# EAGLE design LIC_rack_BM4-01 (EAGLE 7.2.0)
AUTHOR: M. Petrilak; VERSION: 01

## Sheet 1 of 2
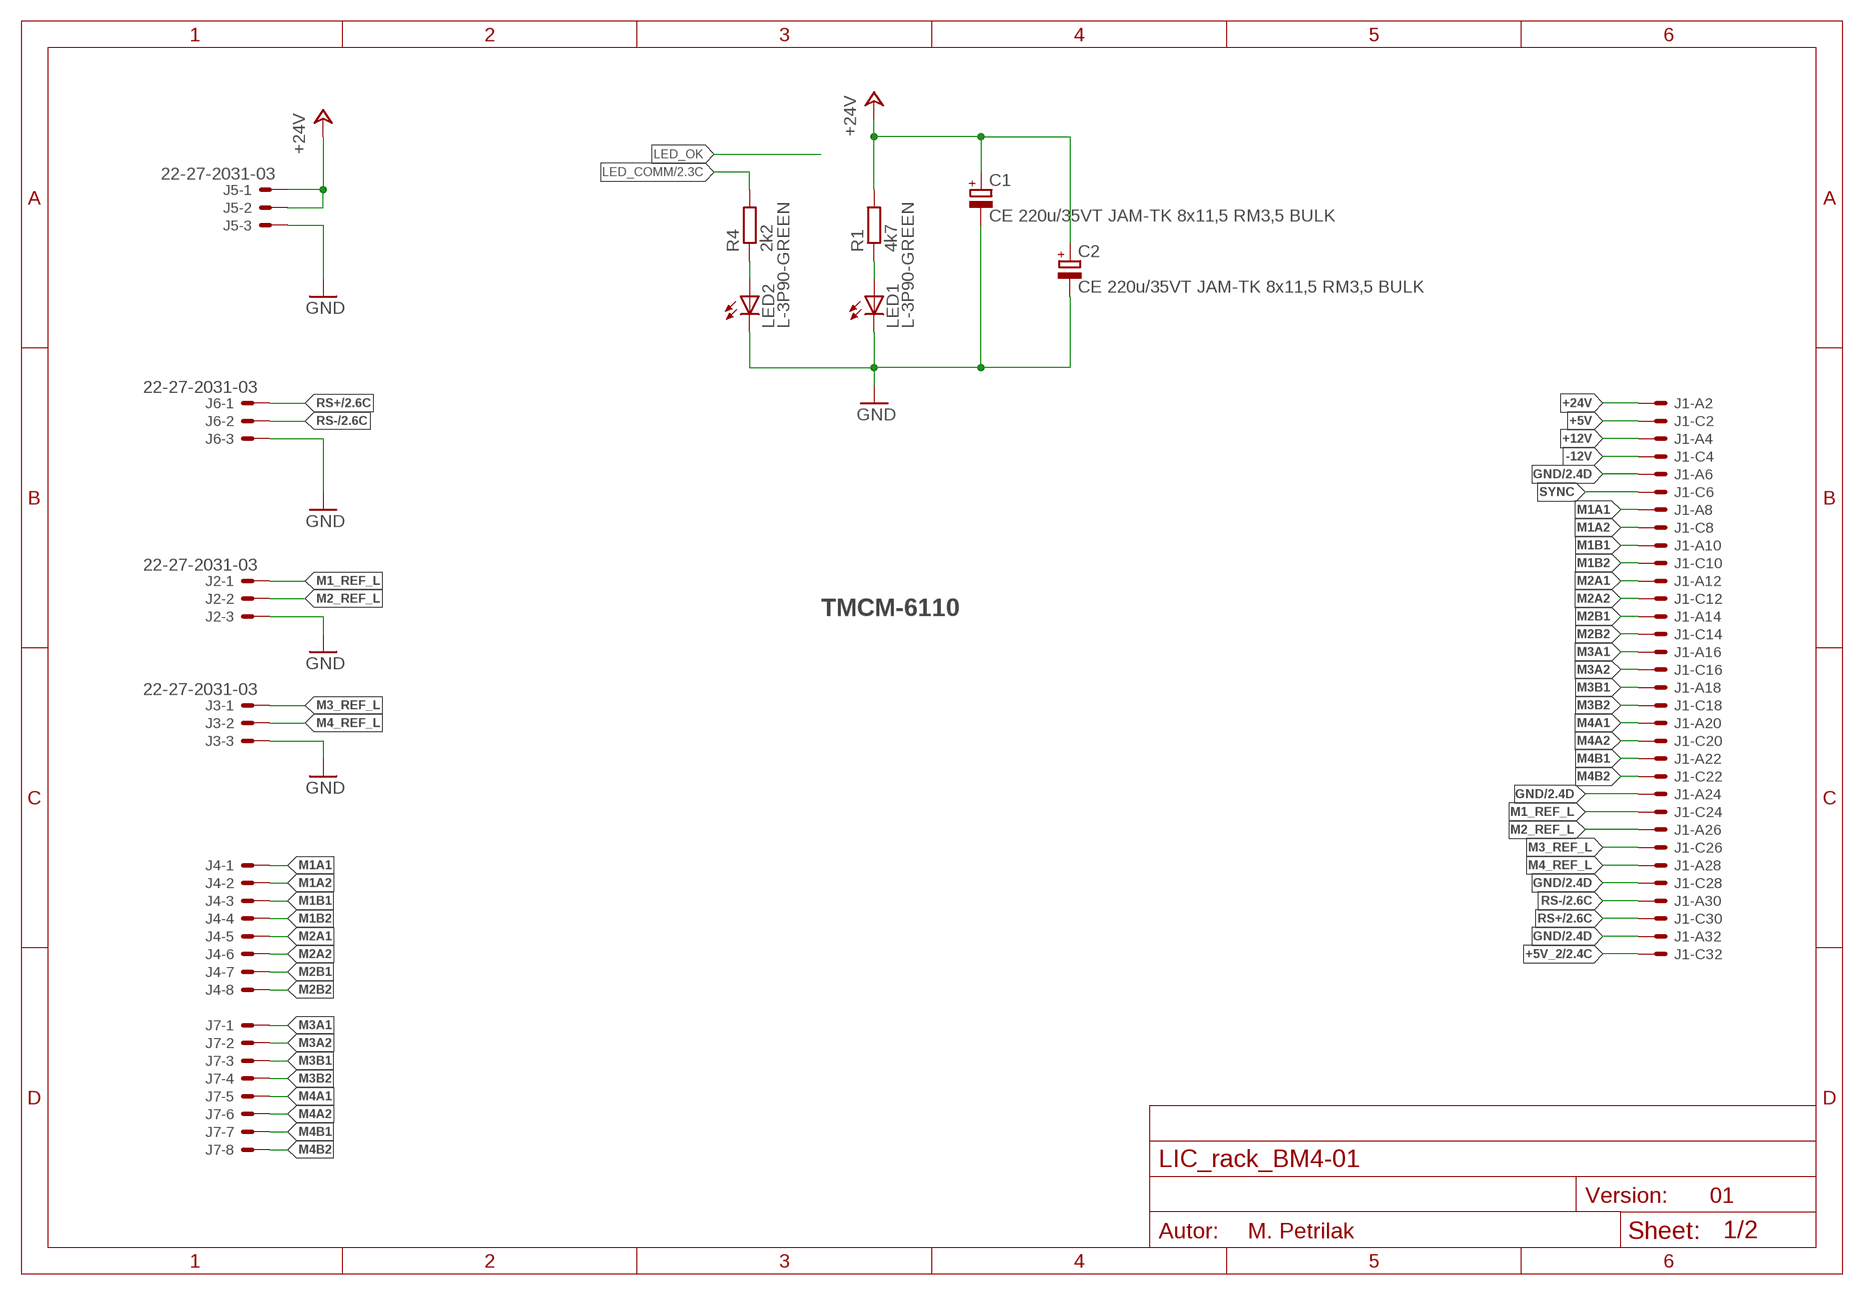
[diagram p0: schematic, sheet 1]

### Parts
C1  CE 220u/35VT JAM-TK 8x11,5 RM3,5 BULK  CPOL-EUE3.5-8L  [E3,5-8L]
C2  CE 220u/35VT JAM-TK 8x11,5 RM3,5 BULK  CPOL-EUE3.5-8L  [E3,5-8L]
J1  VG32SP  [VG32P]
J2  22-27-2031-03  [6410-03]
J3  22-27-2031-03  [6410-03]
J4  22-27-2081-08  [6410-08]
J5  22-27-2031-03  [6410-03]
J6  22-27-2031-03  [6410-03]
J7  22-27-2081-08  [6410-08]
LED1  L-3P90-GREEN  [L-3P90]
LED2  L-3P90-GREEN  [L-3P90]
R1  4k7  R-EU_R1206  [R1206]
R4  2k2  R-EU_R1206  [R1206]

### Nets
+5V: J1.C2
+5V_2: J1.C32 ; also sheet 2
+12V: J1.A4
+24V: C1.+ C2.+ J1.A2 J5.1 J5.2 R1.2
-12V: J1.C4
GND: C1.- C2.- J1.A6 J1.A24 J1.A32 J1.C28 J2.3 J3.3 J5.3 J6.3 LED1.K(C) LED2.K(C) ; also sheet 2
LED_COMM: R4.2 ; also sheet 2
M1_REF_L: J1.C24 J2.1
M1A1: J1.A8 J4.1
M1A2: J1.C8 J4.2
M1B1: J1.A10 J4.3
M1B2: J1.C10 J4.4
M2_REF_L: J1.A26 J2.2
M2A1: J1.A12 J4.5
M2A2: J1.C12 J4.6
M2B1: J1.A14 J4.7
M2B2: J1.C14 J4.8
M3_REF_L: J1.C26 J3.1
M3A1: J1.A16 J7.1
M3A2: J1.C16 J7.2
M3B1: J1.A18 J7.3
M3B2: J1.C18 J7.4
M4_REF_L: J1.A28 J3.2
M4A1: J1.A20 J7.5
M4A2: J1.C20 J7.6
M4B1: J1.A22 J7.7
M4B2: J1.C22 J7.8
N$3: LED1.A R1.1
N$6: LED2.A R4.1
RS+: J1.C30 J6.1 ; also sheet 2
RS-: J1.A30 J6.2 ; also sheet 2
SYNC: J1.C6

### Notes on the sheet
- TMCM-6110

## Sheet 2 of 2
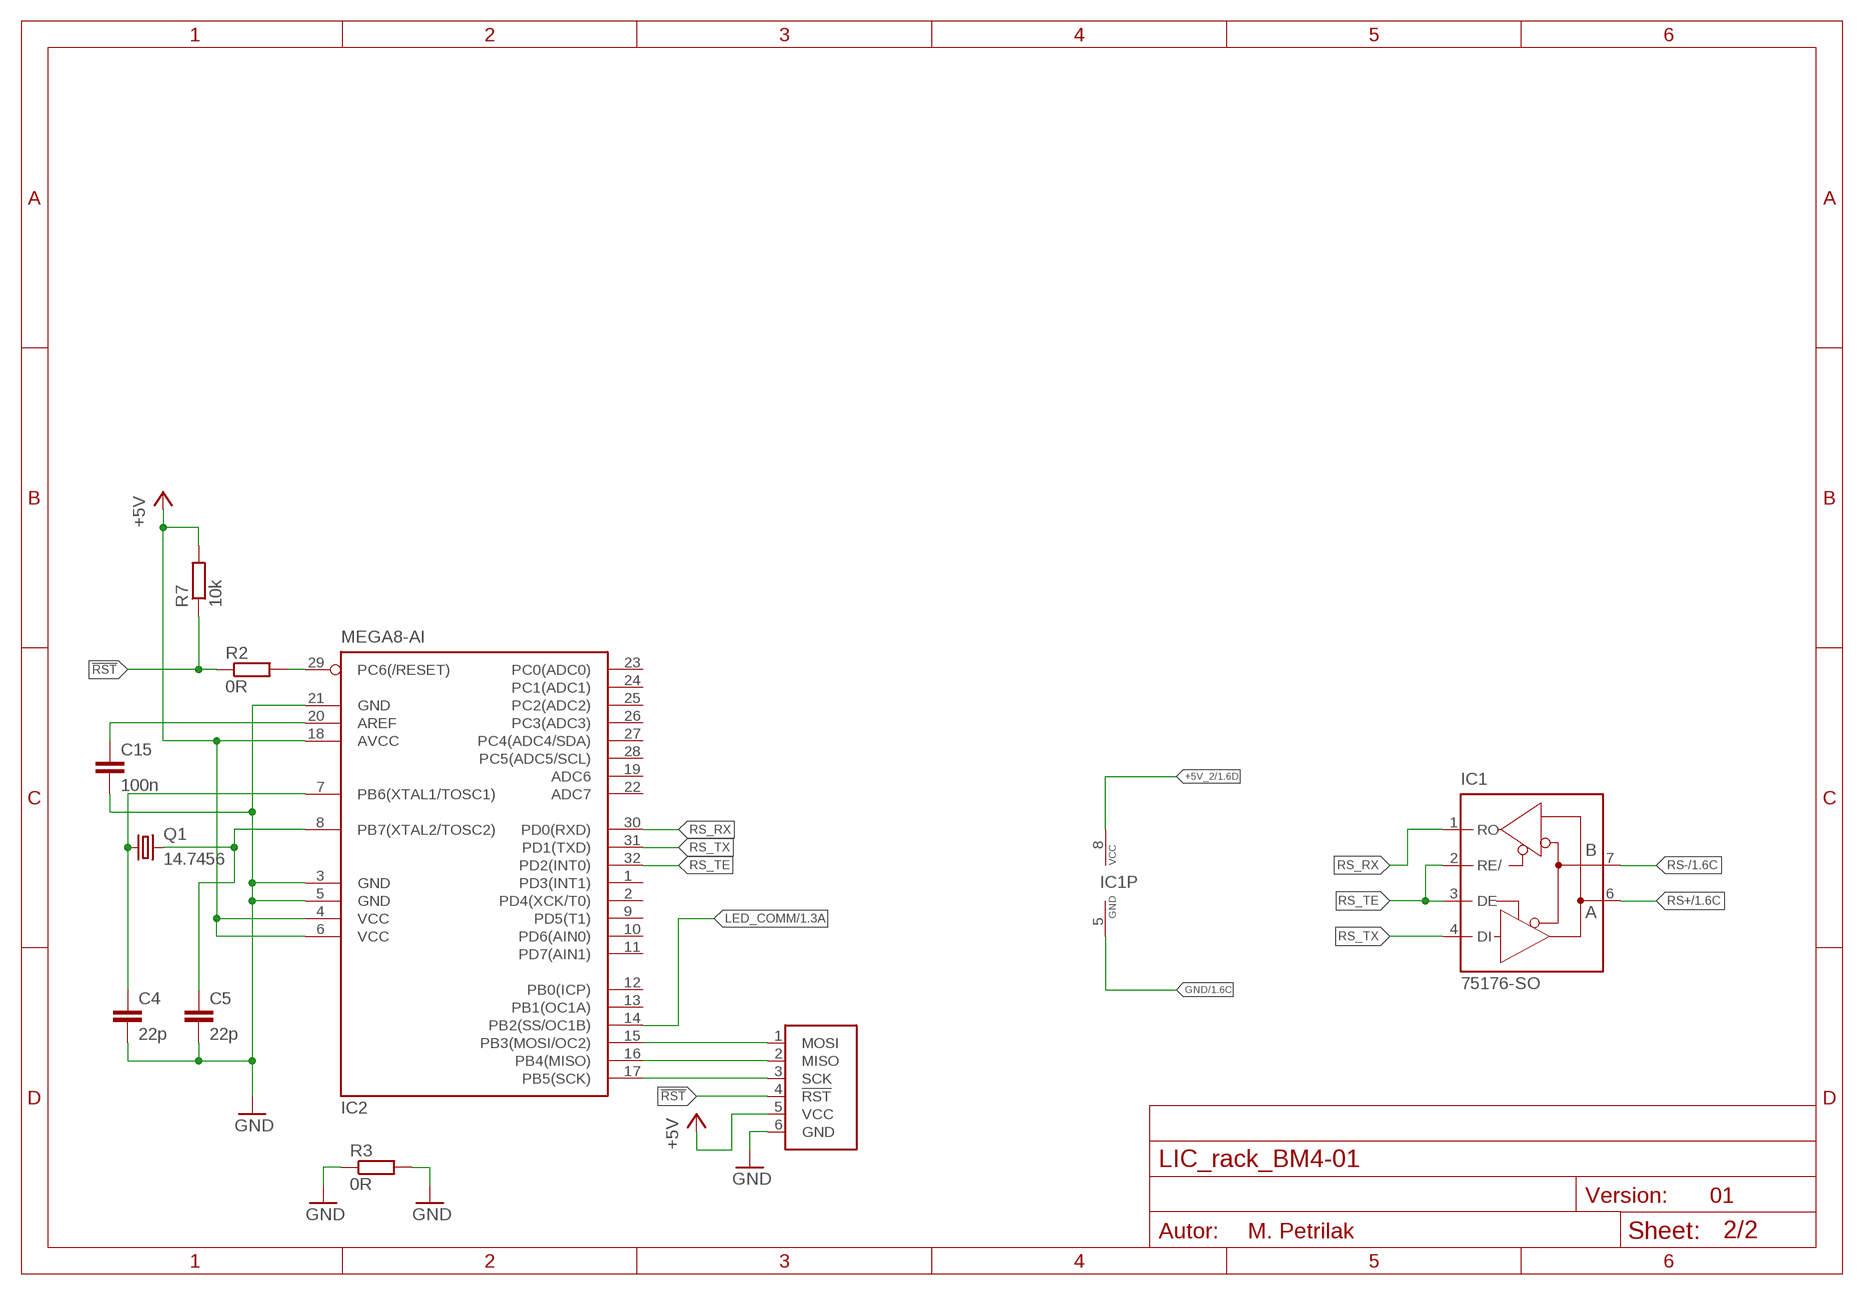
[diagram p1: schematic, sheet 2]

### Parts
C4  22p  C-EUC0805  [C0805]
C5  22p  C-EUC0805  [C0805]
C15  100n  C-EUC1206  [C1206]
IC1  75176-SO  [SO08]
IC2  MEGA8-AI  [TQFP32-08]
Q1  14.7456  XTAL  [HC49U70]
R2  0R  R-EU_R1206  [R1206]
R3  0R  R-EU_R1206  [R1206]
R7  10k  R-EU_R1206  [R1206]
U1  ATPROG-V  [6410-06]

### Nets
!RST: R2.1 R7.1 U1.4(!RST)
+5V_2: IC1.8(VCC) IC2.4(VCC) IC2.6(VCC) IC2.18(AVCC) R7.2 U1.5(VCC) ; supply symbol labelled +5V ; also sheet 1
AREF: C15.1 IC2.20(AREF)
GND: C4.2 C5.2 C15.2 IC1.5(GND) IC2.3(GND) IC2.5(GND) IC2.21(GND) R3.1 R3.2 U1.6(GND) ; also sheet 1
LED_COMM: IC2.14(PB2(SS/OC1B)) ; also sheet 1
N$5: IC2.29(PC6(/RESET)) R2.2
PROG_MISO: IC2.16(PB4(MISO)) U1.2(MISO)
PROG_MOSI: IC2.15(PB3(MOSI/OC2)) U1.1(MOSI)
PROG_SCK: IC2.17(PB5(SCK)) U1.3(SCK)
RS+: IC1.6(A) ; also sheet 1
RS-: IC1.7(B) ; also sheet 1
RS_RX: IC1.1(RO) IC2.30(PD0(RXD))
RS_TE: IC1.2(RE/) IC1.3(DE) IC2.32(PD2(INT0))
RS_TX: IC1.4(DI) IC2.31(PD1(TXD))
XTAL1: C4.1 IC2.7(PB6(XTAL1/TOSC1)) Q1.1
XTAL2: C5.1 IC2.8(PB7(XTAL2/TOSC2)) Q1.2
Unconnected: IC2.1(PD3(INT1)) IC2.2(PD4(XCK/T0)) IC2.9(PD5(T1)) IC2.10(PD6(AIN0)) IC2.11(PD7(AIN1)) IC2.12(PB0(ICP)) IC2.13(PB1(OC1A)) IC2.19(ADC6) IC2.22(ADC7) IC2.23(PC0(ADC0)) IC2.24(PC1(ADC1)) IC2.25(PC2(ADC2)) IC2.26(PC3(ADC3)) IC2.27(PC4(ADC4/SDA)) IC2.28(PC5(ADC5/SCL))

## Library data of the parts
C1 C2 = rcl:CPOL-EU: POLARIZED CAPACITOR, European symbol
C4 C5 C15 = rcl:C-EU: CAPACITOR, European symbol
IC1 = maxim:75176
IC2 = atmel:MEGA8: MICROCONTROLLER 8 Kbytes FLASH, 1 kbytes SRAM, 512 bytes EEPROM, USART, 6-channel 10 bit ADC, 2-channel 8 bit ADC Pin compatible with Atmega48, ATMega88, ATMega168 Source: avr.lbr
J1 = 19inch:VG32S: PCB EUROCARD, 32-pin type C/AC, 5.08 mm
J2 J3 J5 J6 = con-molex:22-?-03: CONNECTOR wire to board 2.54 mm (.1 inch) pitch header
J4 J7 = con-molex:22-?-08: CONNECTOR wire to board 2.54 mm (.1 inch) pitch header
LED1 LED2 = led:L-3P90
Q1 = crystal:XTAL
R1-R4 R7 = rcl:R-EU_: RESISTOR, European symbol
U1 = con-molex:ATPROG

## Board
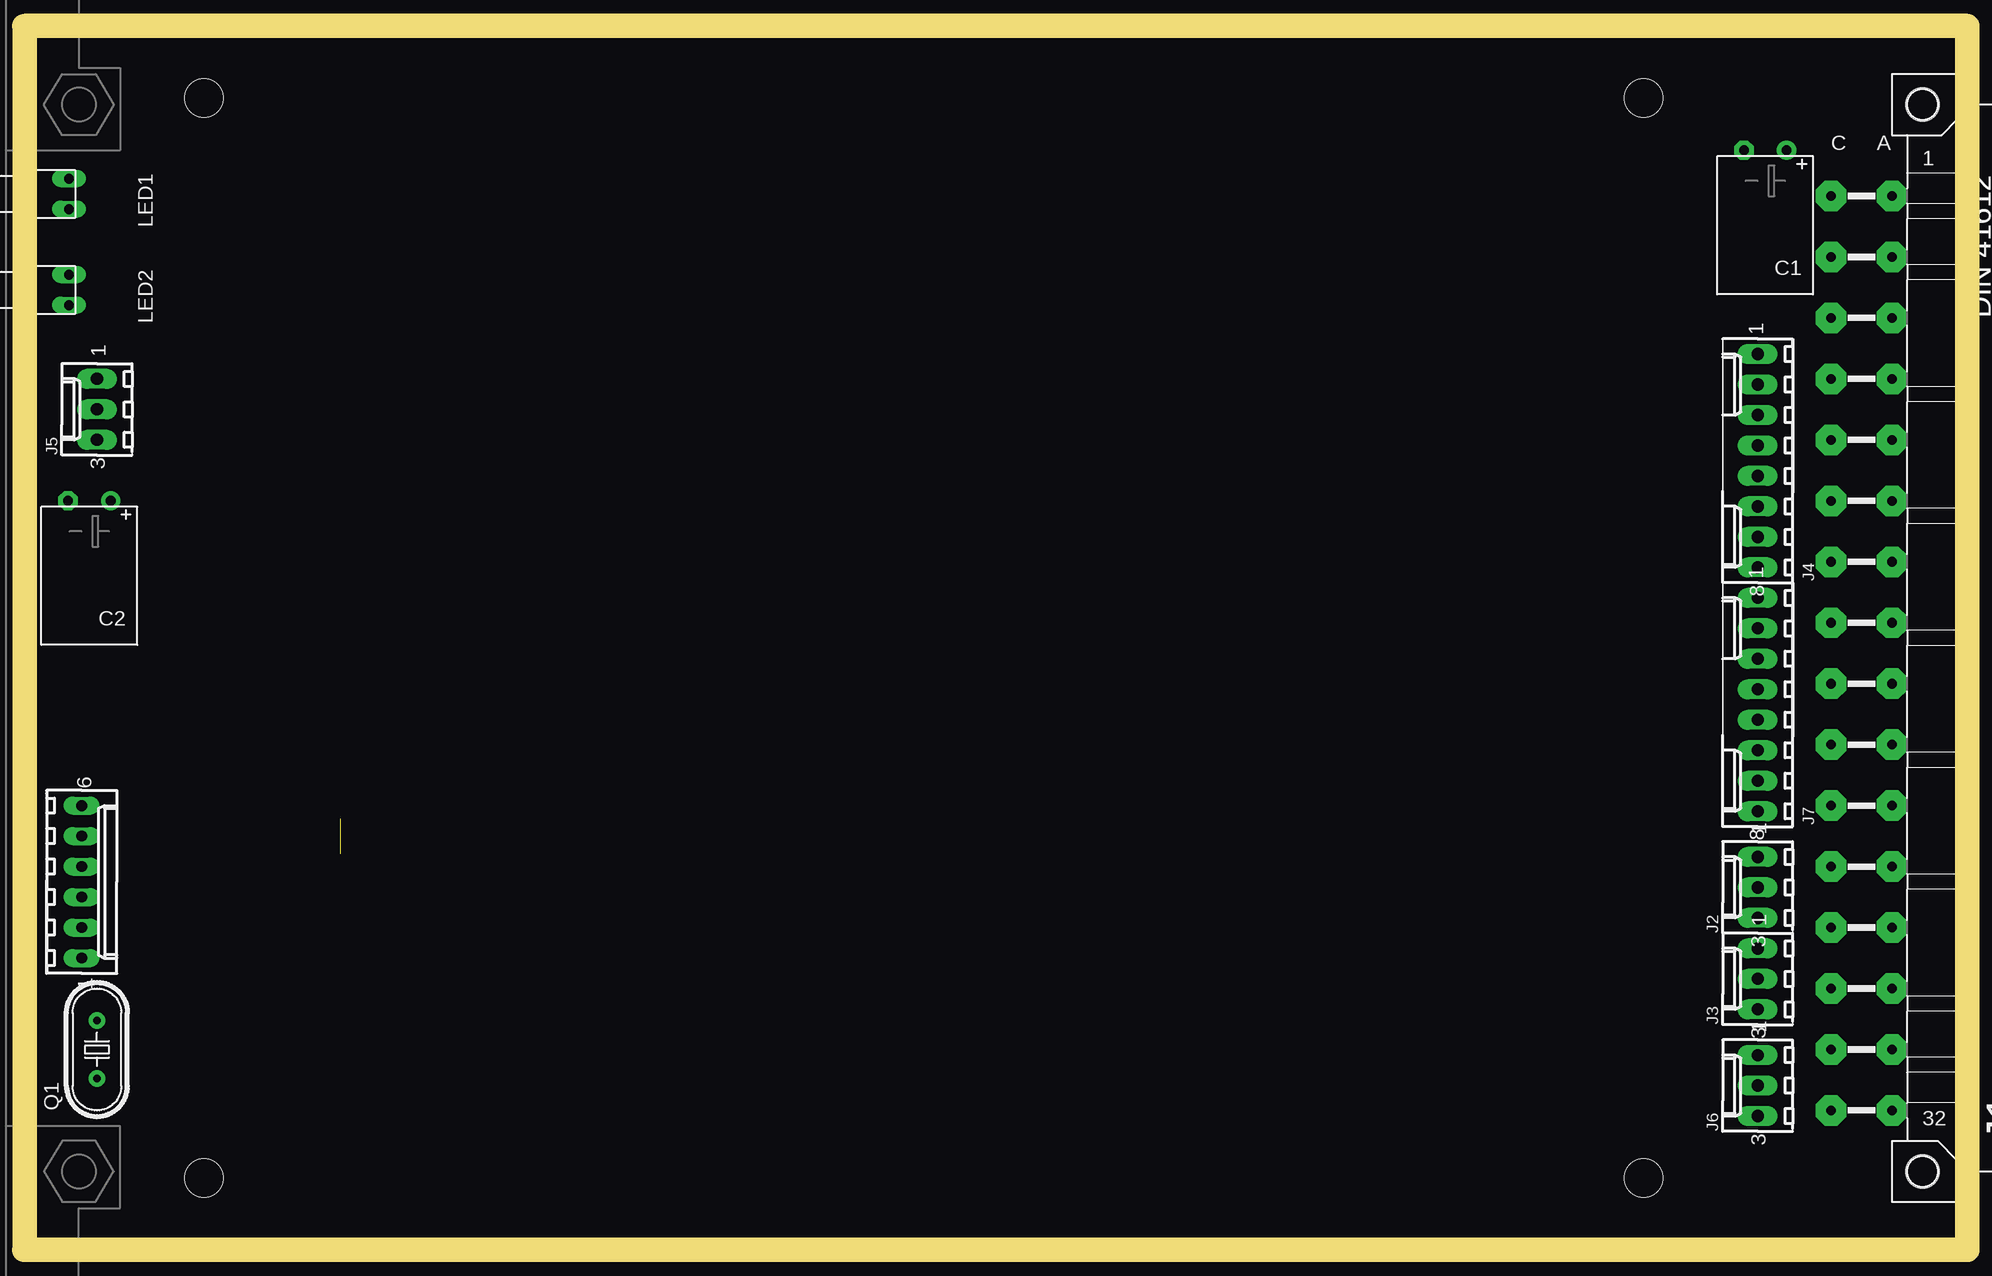
[diagram p2: board, top side]
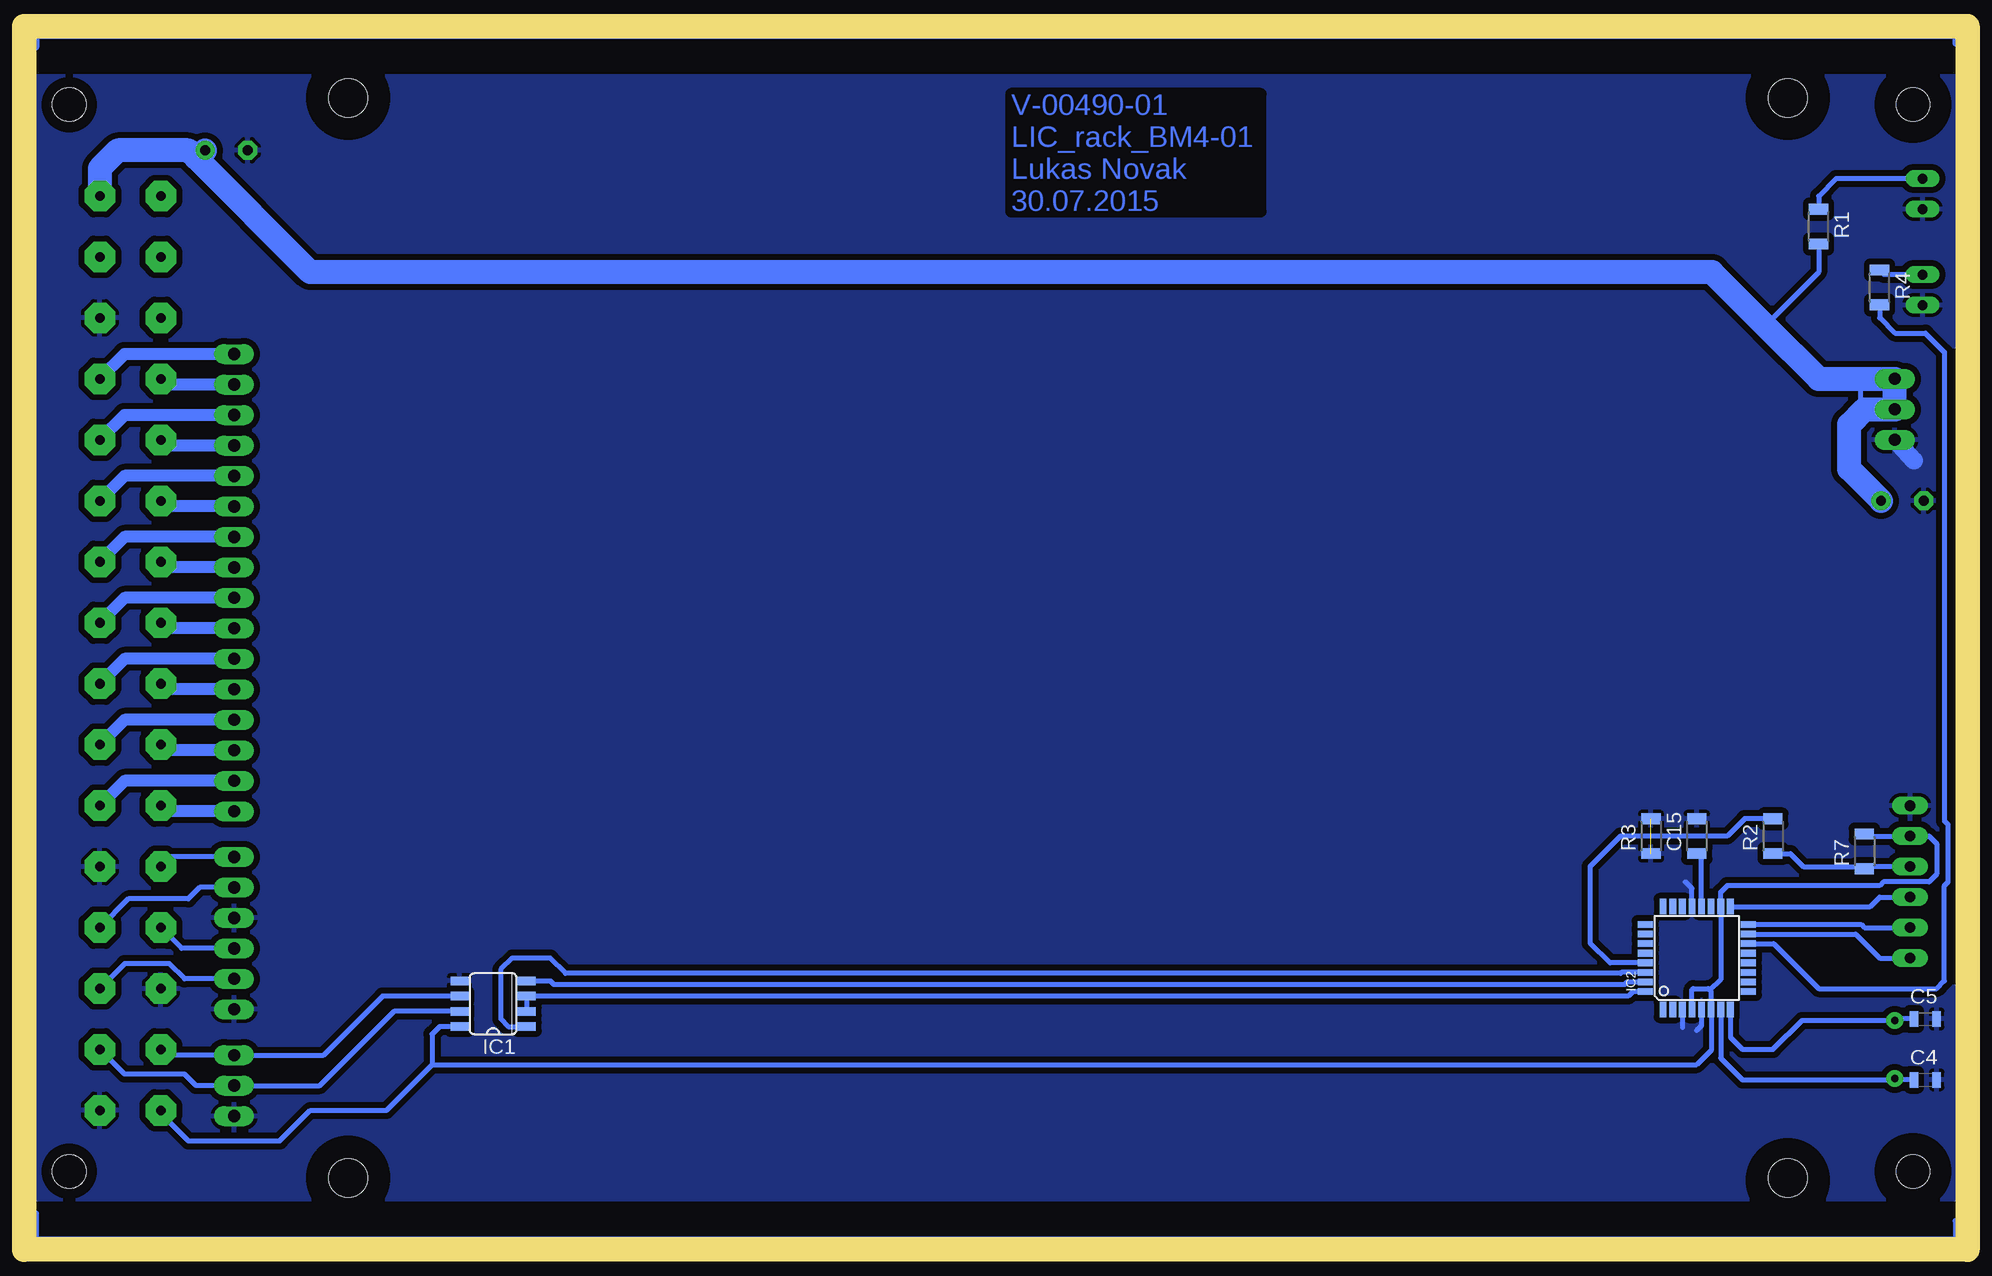
[diagram p3: board, bottom side, seen from below]

Size 160 x 100 mm. Coordinates in mm from the lower left corner, seen from the top.
Copper layers (1*16): Top 0.04mm / dielectric 1.5mm / Bottom 0.04mm
Design rules "Michal_mid *": minimum track width 0.2mm, minimum drill 0.6mm, track to track 0.5mm, track to pad 0.5mm, pad to pad 0.3mm, via to via 0.3mm, smd to smd 0mil, copper to edge 0.0001mm, drill to drill 0.2mm, minimum pad ring 0.3mm, minimum via ring 0.3mm, stop-mask expansion 0.1mm, vias tented up to drill 0.5mm, thermal gap 0.3mm
Holes 3.2 mm at 14,95 14,5 134,95 134,5
bRestrict: area 10.5,91.5 to 17.5,98.5; area 130.5,91.5 to 137.5,98.5; area 10.5,1.3 to 17.5,8.3; area 130.5,1.5 to 137.5,8.5

### Footprints (pad centres in the part's own frame; a part is rotated, then mirrored left to right if it is on the bottom)
E3,5-8L = drill 0.813 pad 1.6: + -1.778,0 | drill 0.813 pad 1.6 octagon: - 1.778,0
C0805 = smd 0.7 x 1.3: 1 -0.95,0; 2 0.95,0
C1206 = smd 0.9 x 1.6: 1 -1.45,0; 2 1.45,0
SO08 = smd 0.72 x 1.5: 1 -1.905,-2.8; 2 -0.635,-2.8; 3 0.635,-2.8; 4 1.905,-2.8; 5 1.905,2.8; 6 0.635,2.8; 7 -0.635,2.8; 8 -1.905,2.8
TQFP32-08 = smd 1.27 x 0.559: 1 -4.293,2.8; 2 -4.293,2; 3 -4.293,1.2; 4 -4.293,0.4; 5 -4.293,-0.4; 6 -4.293,-1.2; 7 -4.293,-2; 8 -4.293,-2.8; 17 4.293,-2.8; 18 4.293,-2; 19 4.293,-1.2; 20 4.293,-0.4; 21 4.293,0.4; 22 4.293,1.2; 23 4.293,2; 24 4.293,2.8 | smd 0.559 x 1.27: 9 -2.8,-4.293; 10 -2,-4.293; 11 -1.2,-4.293; 12 -0.4,-4.293; 13 0.4,-4.293; 14 1.2,-4.293; 15 2,-4.293; 16 2.8,-4.293; 25 2.8,4.293; 26 2,4.293; 27 1.2,4.293; 28 0.4,4.293; 29 -0.4,4.293; 30 -1.2,4.293; 31 -2,4.293; 32 -2.8,4.293
VG32P = drill 0.8 pad 2.54 octagon: A2 154.7,36.83; A4 154.7,31.75; A6 154.7,26.67; A8 154.7,21.59; A10 154.7,16.51; A12 154.7,11.43; A14 154.7,6.35; A16 154.7,1.27; A18 154.7,-3.81; A20 154.7,-8.89; A22 154.7,-13.97; A24 154.7,-19.05; A26 154.7,-24.13; A28 154.7,-29.21; A30 154.7,-34.29; A32 154.7,-39.37; C2 149.62,36.83; C4 149.62,31.75; C6 149.62,26.67; C8 149.62,21.59; C10 149.62,16.51; C12 149.62,11.43; C14 149.62,6.35; C16 149.62,1.27; C18 149.62,-3.81; C20 149.62,-8.89; C22 149.62,-13.97; C24 149.62,-19.05; C26 149.62,-24.13; C28 149.62,-29.21; C30 149.62,-34.29; C32 149.62,-39.37 | hole 2.794: 3.57,44.45; 3.57,-44.45; 157.24,44.45; 157.24,-44.45
6410-03 = drill 1.016 long: 1 2.54,0; 2 0,0; 3 -2.54,0
6410-08 = drill 1.016 long: 1 8.89,0; 2 6.35,0; 3 3.81,0; 4 1.27,0; 5 -1.27,0; 6 -3.81,0; 7 -6.35,0; 8 -8.89,0
L-3P90 = drill 0.813 long: A 4.7,1.27; K 4.7,-1.27
HC49U70 = drill 0.6 pad 1.4: 1 -2.413,0; 2 2.413,0
R1206 = smd 0.9 x 1.6: 1 -1.45,0; 2 1.45,0
6410-06 = drill 0.9 long: 1 6.35,0; 2 3.81,0; 3 1.27,0; 4 -1.27,0; 5 -3.81,0; 6 -6.35,0

### Placement (x,y rotation side)
C1  144.15,90.64 180 top
C2  4.45,61.43 180 top
C4  2.54,13.17 0 bottom
C5  2.54,18.25 0 bottom
C15  21.59,33.49 90 bottom
IC1  121.92,19.52 90 bottom
IC2  21.59,23.33 90 bottom
J1  0,50 0 top
J2  143.51,29.21 90 top
J3  143.51,21.59 90 top
J4  143.51,64.77 90 top
J5  5.08,69.05 90 top
J6  143.51,12.7 90 top
J7  143.51,44.45 90 top
LED1  -1.94,87 0 top
LED2  -1.94,79 0 top
Q1  5.08,15.71 90 top
R1  11.43,84.29 270 bottom
R2  15.24,33.49 90 bottom
R3  25.4,33.49 90 bottom
R4  6.35,79.21 270 bottom
R7  7.62,32.22 90 bottom
U1  3.81,29.68 270 top

### Tracks (layer width: path | path; a pad name or v marks a point on that pad's centre or on a via)
!RST
  Bottom 0.406: U1.4 7.44,30.95 R7.1 7.8,30.95 12.7,30.95 13.79,32.04 R2.1
+5V_2
  Bottom 0.406: J1.C32 149.62,10.39 147.32,8.09 139.7,8.09 137.16,10.63 130.81,10.63 127,14.44 | 127,14.44 21.59,14.44 20.39,15.64 IC2.6 20.39,20.54 20.48,20.63 | 20.48,20.63 20.64,20.79 21.91,20.79 21.99,20.71 IC2.4 | R7.2 7.44,33.49 U1.5 2.22,33.49 1.59,32.86 1.59,30.32 2.22,29.68 6.03,29.68 6.35,29.36 19.05,29.36 19.59,28.82 IC2.18 19.59,21.52 20.48,20.63 | IC1.8 126.36,17.62 127,16.98 127,14.44
+24V
  Bottom 0.406: R1.2 11.43,80.48 15.88,76.03
  Bottom 2: J1.A2 154.7,89.14 153.2,90.64 147.32,90.64 146.69,90 | 146.69,90 137.16,80.48 20.32,80.48 15.88,76.03 11.43,71.59 J5.1 J5.2 7.62,69.05 8.89,67.78 8.89,64.1 C2.+ | C1.+ 146.56,90 146.69,90
AREF
  Bottom 0.406: IC2.20 21.19,31.64 C15.1
GND  (1 unrouted)
  Bottom 0.406: IC2.3 22.79,17.55 | IC2.21 21.99,29.13 22.54,29.68 | IC2.5 21.19,17.7 21.59,17.3
  Bottom 1.5: 3.49,64.77 J5.3
  pour Bottom: 0,0 160,0 160,100 0,100
LED_COMM
  Bottom 0.406: R4.2 6.35,76.67 5.08,75.4 2.54,75.4 0.95,73.81 0.95,34.76 0.64,34.44 0.64,29.68 0.95,29.36 0.95,21.43 1.59,20.79 11.43,20.79 15.17,24.53 IC2.14
M1_REF_L
  Bottom 0.406: J2.1 148.82,31.75 J1.C24
M1A1
  Bottom 1: J4.1 152.63,73.66 J1.A8
M1A2
  Bottom 1: J4.2 149.15,71.12 J1.C8
M1B1
  Bottom 1: J4.3 152.63,68.58 J1.A10
M1B2
  Bottom 1: J4.4 149.15,66.04 J1.C10
M2_REF_L
  Bottom 0.406: J2.2 146.37,29.21 147.32,28.26 152.31,28.26 J1.A26
M2A1
  Bottom 1: J4.5 152.63,63.5 J1.A12
M2A2
  Bottom 1: J4.6 149.15,60.96 J1.C12
M2B1
  Bottom 1: J4.7 152.63,58.42 J1.A14
M2B2
  Bottom 1: J4.8 149.15,55.88 J1.C14
M3_REF_L
  Bottom 0.406: J3.1 147.88,24.13 J1.C26
M3A1
  Bottom 1: J7.1 152.63,53.34 J1.A16
M3A2
  Bottom 1: J7.2 149.15,50.8 J1.C16
M3B1
  Bottom 1: J7.3 152.63,48.26 J1.A18
M3B2
  Bottom 1: J7.4 149.15,45.72 J1.C18
M4_REF_L
  Bottom 0.406: J3.2 147.64,21.59 148.91,22.86 152.63,22.86 J1.A28
M4A1
  Bottom 1: J7.5 152.63,43.18 J1.A20
M4A2
  Bottom 1: J7.6 149.15,40.64 J1.C20
M4B1
  Bottom 1: J7.7 152.63,38.1 J1.A22
M4B2
  Bottom 1: J7.8 149.15,35.56 J1.C22
N$1
  Bottom 0.406: 7.94,71.27 7.94,69.37
N$2
  Bottom 0.5: 0,1.42 0,-0.16 160.02,-0.16 160.02,2.06
N$3
  Bottom 0.406: LED1.A 9.99,88.27 11.43,86.83 R1.1
N$4
  Bottom 0.5: 160.02,99.21 160.02,100.16 0,100.16 0,99.53
N$5
  Bottom 0.406: R2.2 17.6,34.94 19.05,33.49 27.94,33.49 30.48,30.95 30.48,24.6 28.81,22.93 IC2.29
N$6
  Bottom 0.406: LED2.A 5.96,80.27 R4.1
PROG_MISO
  Bottom 0.406: IC2.16 7.88,26.13 7.62,25.87 U1.2
PROG_MOSI
  Bottom 0.406: IC2.15 8.35,25.33 6.35,23.33 U1.1
PROG_SCK
  Bottom 0.406: IC2.17 7.14,27.62 6.35,28.41 U1.3
RS+
  Bottom 0.406: J1.C30 149.15,15.24 J6.1 136.04,15.24 131.13,20.16 IC1.6
RS-
  Bottom 0.406: J1.A30 152.64,13.65 147.64,13.65 146.69,12.7 J6.2 136.36,12.7 130.18,18.89 IC1.7
RS_RX
  Bottom 0.406: IC2.30 27.87,22.13 27.94,22.06 115.89,22.06 117.16,23.33 120.33,23.33 121.28,22.38 121.28,18.25 120.65,17.62 IC1.1
RS_TE
  Bottom 0.406: IC2.32 26.93,20.53 27.3,20.16 IC1.3 IC1.2
RS_TX
  Bottom 0.406: IC2.31 27.4,21.33 27.62,21.11 116.84,21.11 117.16,21.43 IC1.4
XTAL1
  Bottom 0.406: C4.1 4.95,13.17 Q1.1 5.21,13.17 17.78,13.17 19.59,14.98 IC2.7
XTAL2
  Bottom 0.406: C5.1 4.95,18.25 Q1.2 12.83,18.12 15.24,15.71 17.78,15.71 18.79,16.72 IC2.8

### Text on the board
Bottom: V-00490-01 / LIC_rack_BM4-01 / Lukas Novak / 30.07.2015